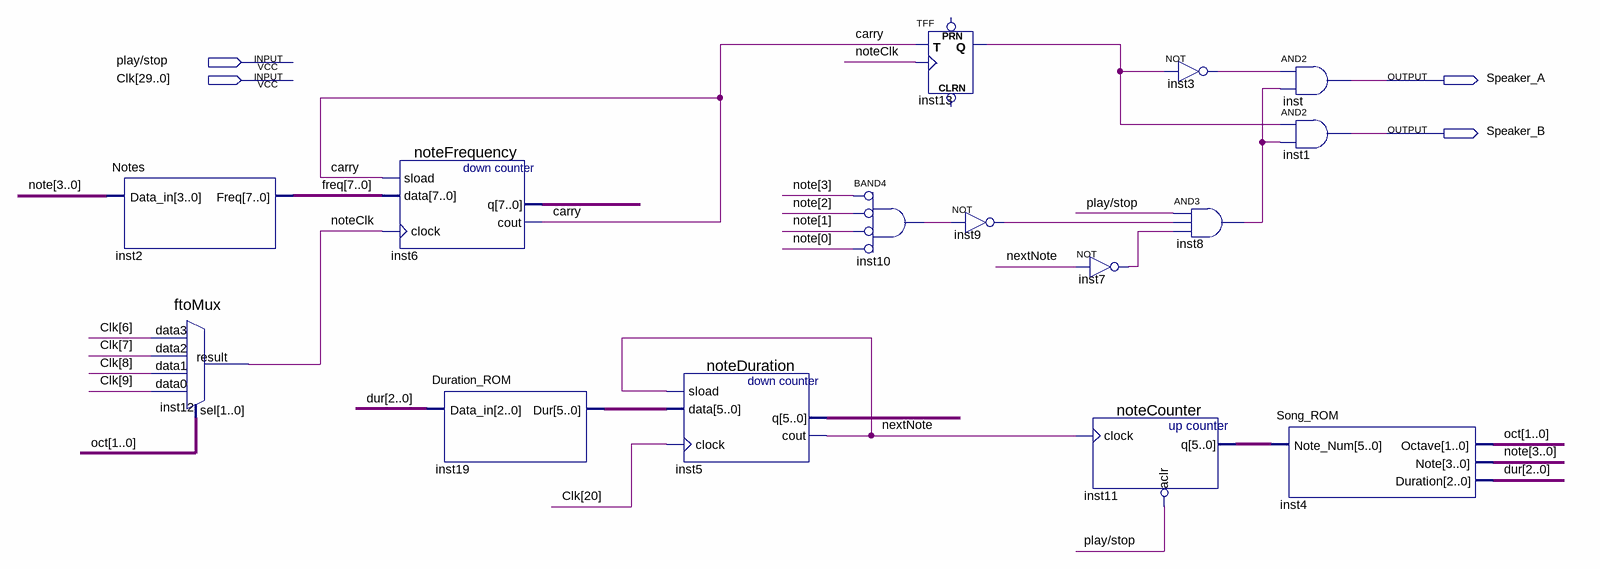
[diagram p0: schematic sheet]
// Quartus schematic Music_Synthesizer.bdf as structural Verilog: 15 symbols, 4 pins
module Music_Synthesizer (
  input  \play/stop ,
  input  [29:0] Clk,
  output Speaker_A,
  output Speaker_B
);

  wire carry, inst3_out, inst7_out, inst8_out, inst9_out, inst10_out, inst13_q, nextNote, noteClk;
  wire [1:0] oct;
  wire [2:0] dur;
  wire [3:0] note;
  wire [5:0] inst5_q, inst11_q, inst19_dur;
  wire [7:0] freq, inst6_q;

  Notes inst2 (.Data_in(note), .Freq(freq));
  ftoMux inst12 (.data3(Clk[6]), .data2(Clk[7]), .data1(Clk[8]), .data0(Clk[9]), .sel(oct), .result(noteClk));
  noteFrequency inst6 (.sload(carry), .data(freq), .clock(noteClk), .q(inst6_q), .cout(carry));
  Duration_ROM inst19 (.Data_in(dur), .Dur(inst19_dur));
  noteDuration inst5 (.sload(nextNote), .data(inst19_dur), .clock(Clk[20]), .q(inst5_q), .cout(nextNote));
  and inst10 (inst10_out, ~note[3], ~note[2], ~note[1], ~note[0]);  // BAND4
  TFF inst13 (.T(carry), .CLK(noteClk), .Q(inst13_q));  // open: PRN, CLRN
  not inst9 (inst9_out, inst10_out);
  not inst7 (inst7_out, nextNote);
  noteCounter inst11 (.clock(nextNote), .aclr(~\play/stop ), .q(inst11_q));
  not inst3 (inst3_out, inst13_q);
  and inst8 (inst8_out, \play/stop , inst9_out, inst7_out);
  and inst (Speaker_A, inst3_out, inst8_out);
  and inst1 (Speaker_B, inst13_q, inst8_out);
  Song_ROM inst4 (.Note_Num(inst11_q), .Octave(oct), .Note(note), .Duration(dur));
endmodule
